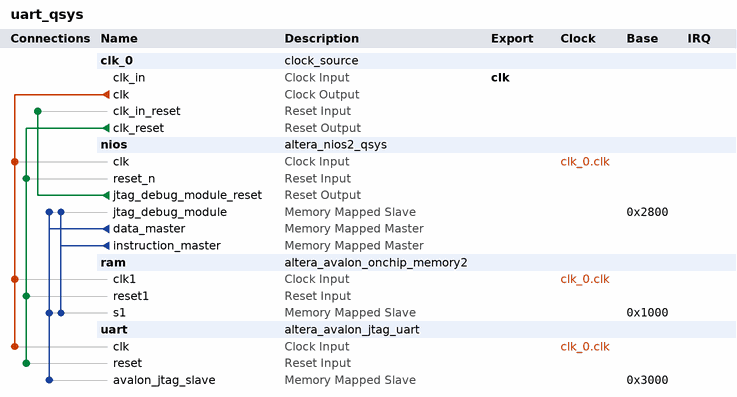
[diagram p0: system contents]
# Platform Designer (Qsys) system uart_qsys, Cyclone IV GX Unknown
# Parameters at their usual value, and those the tool derives, are not listed.
package require -exact qsys 13.1
create_system uart_qsys
set_project_property DEVICE_FAMILY {Cyclone IV GX}
set_project_property DEVICE Unknown

add_instance clk_0 clock_source 13.1
set_instance_parameter_value clk_0 clockFrequency 50000000

add_instance nios altera_nios2_qsys 13.1
set_instance_parameter_value nios resetSlave ram.s1
set_instance_parameter_value nios mmu_TLBMissExcSlave None
set_instance_parameter_value nios exceptionSlave ram.s1
set_instance_parameter_value nios breakSlave nios.jtag_debug_module
set_instance_parameter_value nios impl Tiny
set_instance_parameter_value nios icache_size 4096

add_instance ram altera_avalon_onchip_memory2 13.1
set_instance_parameter_value ram dataWidth 32
set_instance_parameter_value ram dualPort false
set_instance_parameter_value ram initMemContent true
set_instance_parameter_value ram initializationFileName onchip_mem.hex
set_instance_parameter_value ram memorySize 4096

add_instance uart altera_avalon_jtag_uart 13.1
set_instance_parameter_value uart simInteractiveOptions NO_INTERACTIVE_WINDOWS

# connections
add_connection clk_0.clk nios.clk clock
add_connection clk_0.clk ram.clk1 clock
add_connection clk_0.clk uart.clk clock
add_connection clk_0.clk_reset nios.reset_n reset
add_connection clk_0.clk_reset ram.reset1 reset
add_connection clk_0.clk_reset uart.reset reset
add_connection nios.jtag_debug_module_reset clk_0.clk_in_reset reset
add_connection nios.data_master nios.jtag_debug_module avalon
set_connection_parameter_value nios.data_master/nios.jtag_debug_module baseAddress 0x2800
add_connection nios.data_master ram.s1 avalon
set_connection_parameter_value nios.data_master/ram.s1 baseAddress 0x1000
add_connection nios.data_master uart.avalon_jtag_slave avalon
set_connection_parameter_value nios.data_master/uart.avalon_jtag_slave baseAddress 0x3000
add_connection nios.instruction_master nios.jtag_debug_module avalon
set_connection_parameter_value nios.instruction_master/nios.jtag_debug_module baseAddress 0x2800
add_connection nios.instruction_master ram.s1 avalon
set_connection_parameter_value nios.instruction_master/ram.s1 baseAddress 0x1000

# exported interfaces
add_interface clk clock sink
set_interface_property clk EXPORT_OF clk_0.clk_in

set_interconnect_requirement {$system} qsys_mm.clockCrossingAdapter HANDSHAKE
set_interconnect_requirement {$system} qsys_mm.maxAdditionalLatency 1
set_interconnect_requirement {$system} qsys_mm.insertDefaultSlave false

save_system uart_qsys.qsys
